# EAGLE schematic NodeMLX (EAGLE 7.5.0)
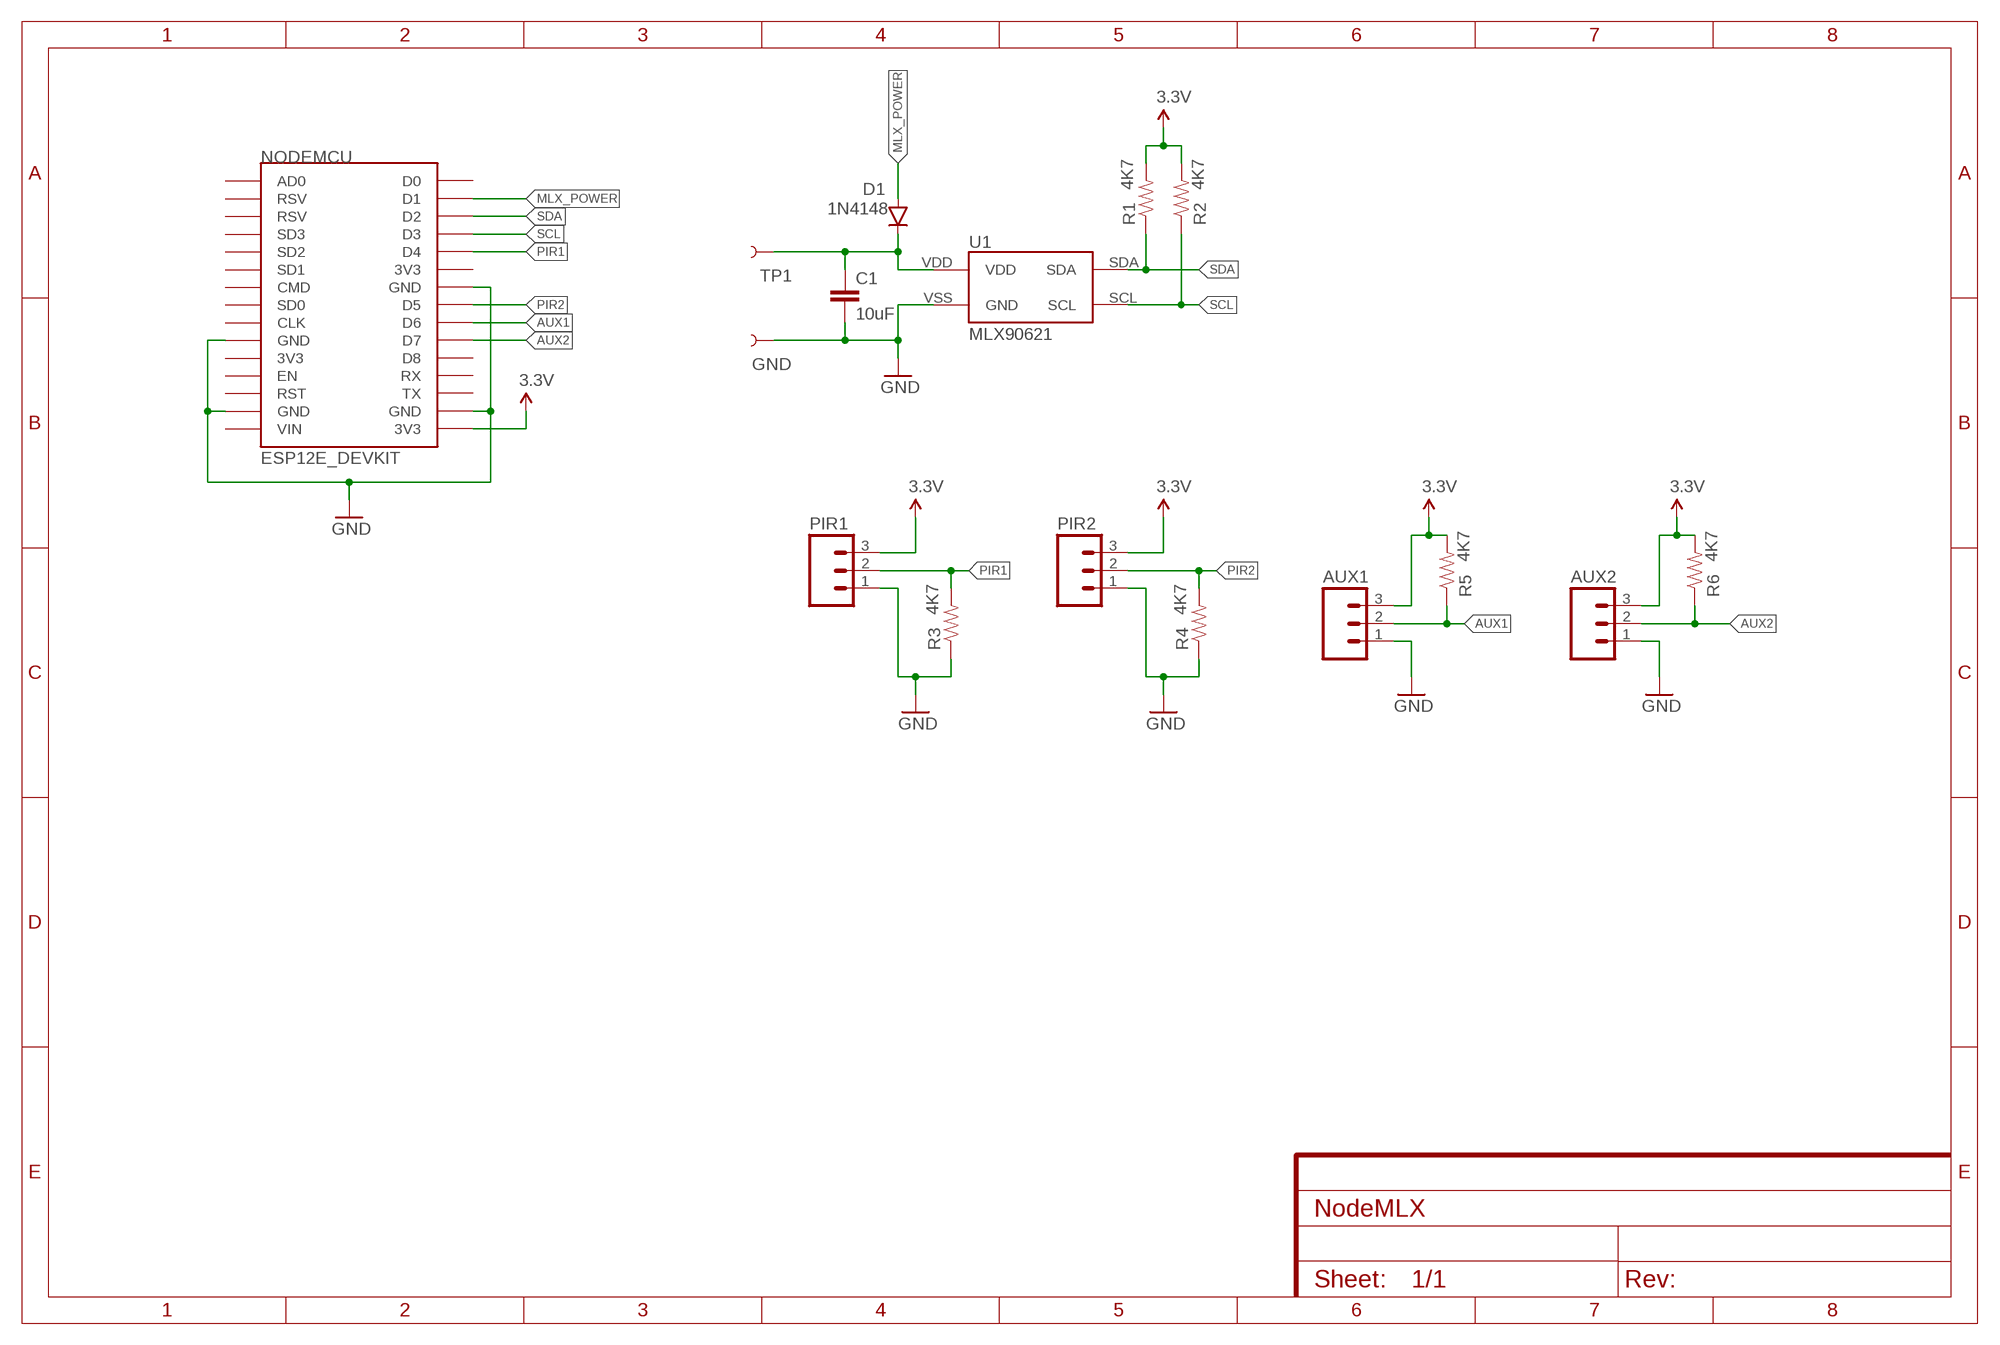
[diagram p0: schematic, sheet 1, part 1 of 2]
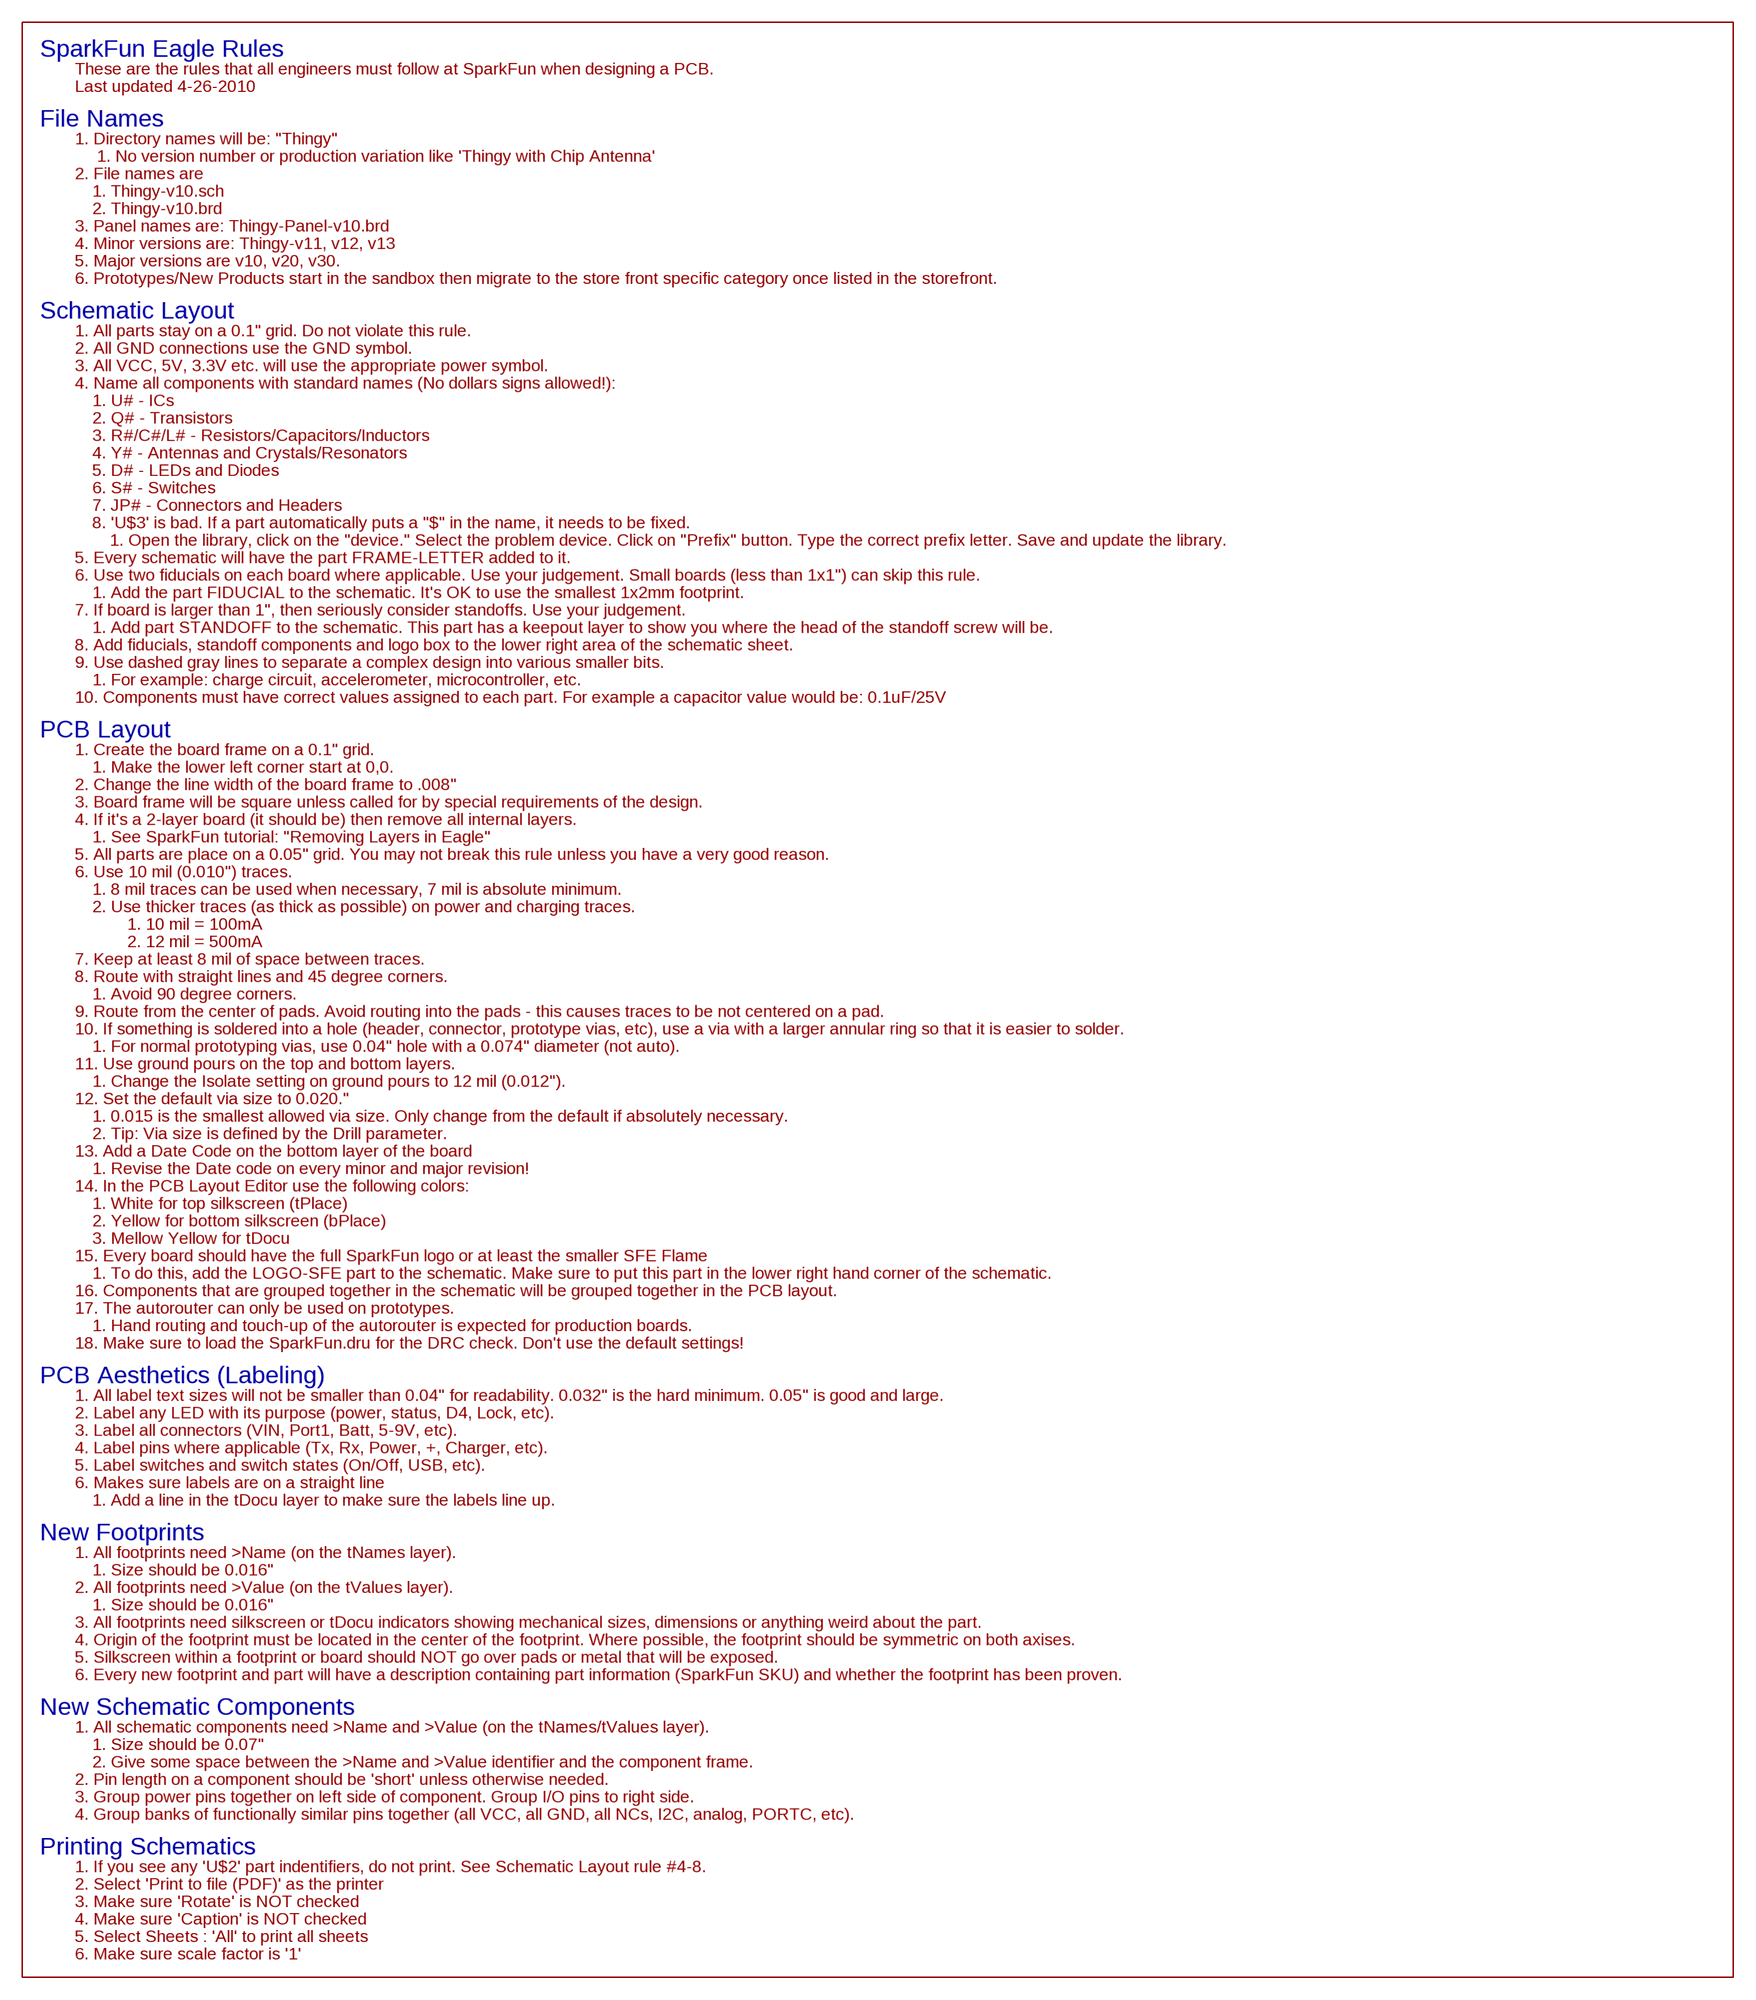
[diagram p1: schematic, sheet 1, part 2 of 2]

## Parts
AUX1  M03PTH  [1X03]
AUX2  M03PTH  [1X03]
C1  10uF  CAP1206  [1206]
D1  1N4148  DIODEBAS16  [SOD-323]
GND  TEST-POINTTP_15TH_THRU  [TP_15TH]
NODEMCU  ESP12E_DEVKIT  [ESP12E_DEVKIT]
PIR1  M03PTH  [1X03]
PIR2  M03PTH  [1X03]
R1  4K7  RESISTOR1206  [1206]
R2  4K7  RESISTOR1206  [1206]
R3  4K7  RESISTOR1206  [1206]
R4  4K7  RESISTOR1206  [1206]
R5  4K7  RESISTOR1206  [1206]
R6  4K7  RESISTOR1206  [1206]
TP1  TEST-POINTTP_15TH_THRU  [TP_15TH]
U1  MLX90621  [MLX90621]

## Nets
3.3V: AUX1.3 AUX2.3 NODEMCU.3V3@2(3V3) PIR1.3 PIR2.3 R1.2 R2.2 R5.2 R6.2
AUX1: AUX1.2 NODEMCU.D6 R5.1
AUX2: AUX2.2 NODEMCU.D7 R6.1
GND: AUX1.1 AUX2.1 C1.2 GND.P$1 NODEMCU.GND@0(GND) NODEMCU.GND@1(GND) NODEMCU.GND@2(GND) NODEMCU.GND@3(GND) PIR1.1 PIR2.1 R3.1 R4.1 U1.VSS(GND)
MLX_POWER: D1.A NODEMCU.D1
N$2: C1.1 D1.C TP1.P$1 U1.VDD
PIR1: NODEMCU.D4 PIR1.2 R3.2
PIR2: NODEMCU.D5 PIR2.2 R4.2
SCL: NODEMCU.D3 R2.1 U1.SCL
SDA: NODEMCU.D2 R1.1 U1.SDA
Unconnected: NODEMCU.3V3@0(3V3) NODEMCU.3V3@1(3V3) NODEMCU.AD0 NODEMCU.CLK NODEMCU.CMD NODEMCU.D0 NODEMCU.D8 NODEMCU.EN NODEMCU.RST NODEMCU.RSV@0(RSV) NODEMCU.RSV@1(RSV) NODEMCU.RX NODEMCU.SD0 NODEMCU.SD1 NODEMCU.SD2 NODEMCU.SD3 NODEMCU.TX NODEMCU.VIN

## Library data of the parts
AUX1 AUX2 PIR1 PIR2 = SparkFun-Connectors:M03: Header 3 Standard 3-pin 0.1" header. Use with straight break away headers (SKU : PRT-00116), right angle break away headers (PRT-00553), swiss pins (PRT-00743), machine pins (PRT-00117), and female headers (PRT-00115). Molex polarized connector foot print use with SKU : PRT-08232 with associated crimp pins and housings.
C1 = SparkFun-Capacitors:CAP: Capacitor Standard 0603 ceramic capacitor, and 0.1" leaded capacitor.
D1 = SparkFun-DiscreteSemi:DIODE: Diode These are standard reverse protection diodes and small signal diodes. SMA package can handle up to about 1A. SOD-323 can handle about 200mA. What the SOD-323 package when ordering, there are some mfgs out there that are 5-pin packages.; PROD_ID: DIO-09646; VALUE: 250mA/100V
GND TP1 = SparkFun-Passives:TEST-POINT: Bare copper test points for troubleshooting or ICT
NODEMCU = ESP12E_DEVKIT (1):ESP12E_DEVKIT: ESP12E DEVKIT BOARD
R1-R6 = SparkFun-Resistors:RESISTOR: Resistor Basic schematic elements and footprints for 0603, 1206, and PTH resistors.
U1 = MLX90621:MLX90621